# Altium schematic sheet Power.SchDoc
size A4; SheetNumber: 2; SheetTotal: 7
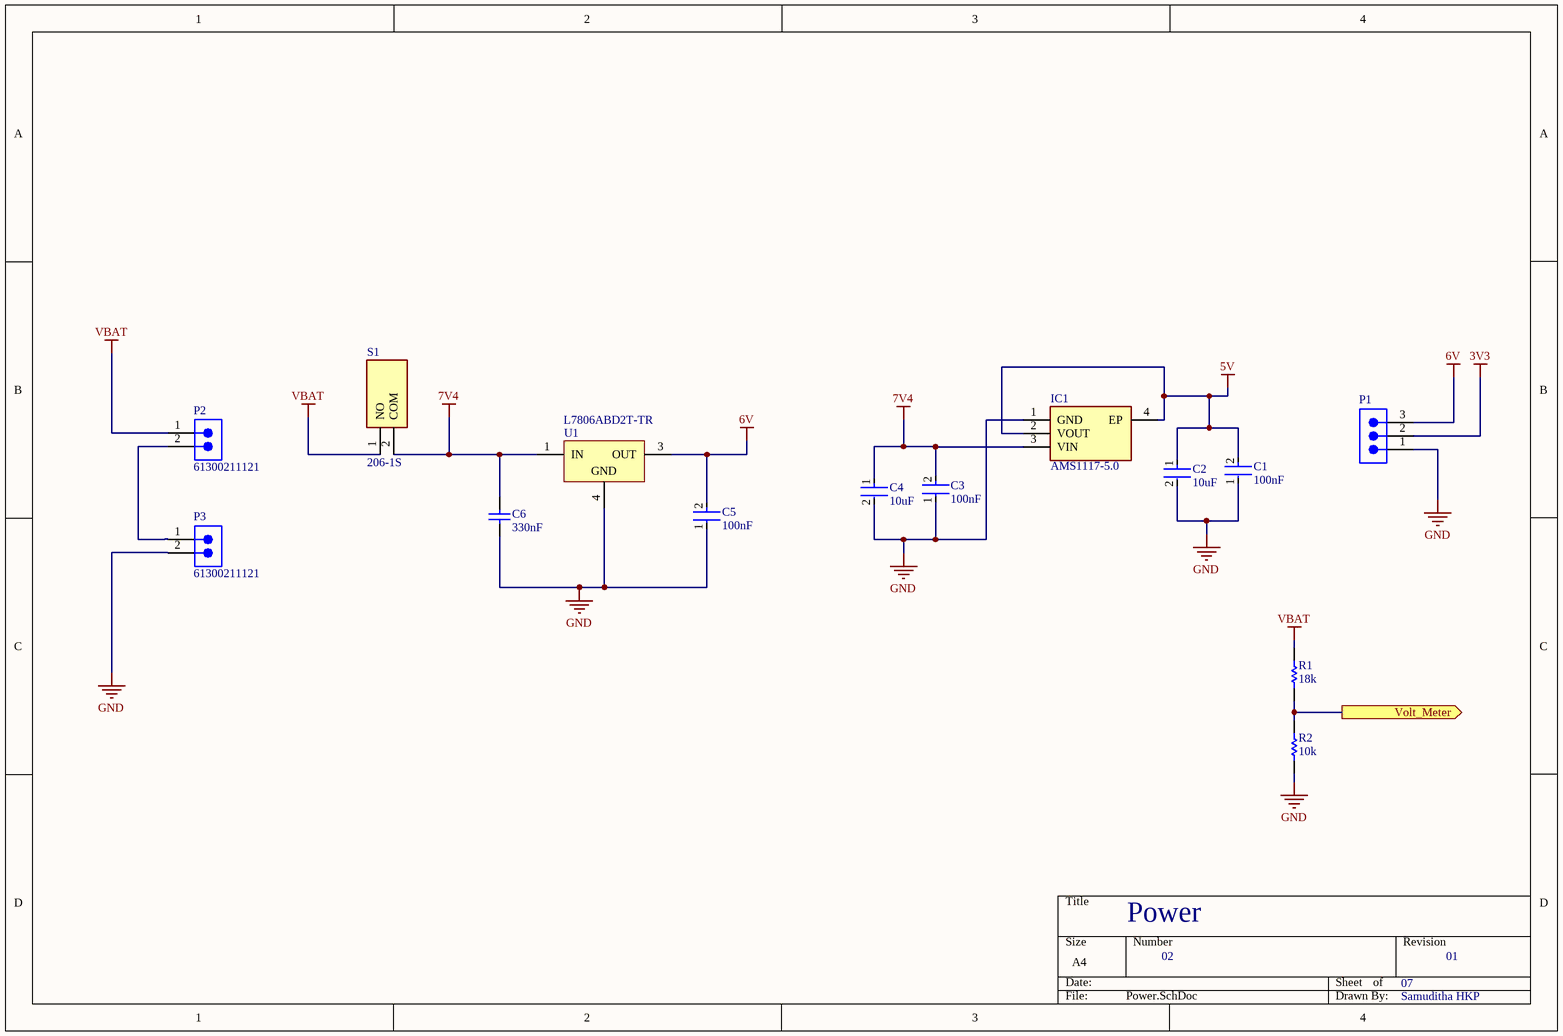
[diagram p0: Power.SchDoc]

## Parts
C1  100nF  [FP-GRM15-MFG]
C2  10uF  [FP-GRM155-0_15-IPC_B]
C3  100nF  [FP-GRM15-MFG]
C4  10uF  [FP-GRM155-0_15-IPC_B]
C5  100nF  [FP-GRM15-MFG]
C6  330nF  [CAPC1005X55X25ML05T10]
IC1  AMS1117-5.0  [SOT290P700X180-4N]
P1  61300311021  [61300311021]  (value not drawn)
P2  61300211121  [61300211121]
P3  61300211121  [61300211121]
R1  18k  [RESC1005X40X25LL05T10]
R2  10k  [RESC1005X40X25LL05T10]
S1  206-1S  [2061S]
U1  L7806ABD2T-TR  [TO-263_N]

## Ports
Volt_Meter (out, see Main[1A], MCU[1A])

## Nets
3V3: P1.2
5V: C1.2 C2.1 IC1.2(VOUT) IC1.4(EP)
6V: C5.2 P1.3 U1.3(OUT)
7V4: C3.2 C4.1 C6.2 IC1.3(VIN) S1.2(COM) U1.1(IN)
GND: C1.1 C2.2 C3.1 C4.2 C5.1 C6.1 IC1.1(GND) P1.1 P3.2 R2.1 U1.4(GND)
VBAT: P2.1 R1.2 S1.1(NO)
Volt_Meter: R1.1 R2.2 ; port Volt_Meter
NetP2_2: P2.2 P3.1

## Notes on the sheet
- Power
- 02
- 07
- 01
- Samuditha HKP

## Library data of the parts
C1 C3 C5 = CMP-2100-03641-2: CAP CER 0.1UF 16V X7R 0402; Manufacturer Part Number: GRM155R71C104KA88D; Manufacturer: Murata; Standoff Height: 0mm; Tolerance: 10%; Voltage Rating: 16Vdc; Material: Ceramic; Capacitance: 0.10μF; Value: 0.10μF; RoHS: TRUE; Temperature Characteristic: X7R; Octopart: https://octopart.com/grm155r71c104ka88d-murata-196880; Digikey Description: CAP CER 0.1UF 16V X7R 0402; Device Class L3: Ceramic Capacitors; Height: 0.55mm; ComponentLink2Description: Datasheet; Temperature Range Low: -55°C; Ipc Land Pattern Name: CAPC10050X219; ComponentLink2URL: https://search.murata.co.jp/Ceramy/image/img/A01X/G101/ENG/GRM155R71H471KA01-01A.pdf; Device Class L1: Passive Components; Lead Free: yes; Category: Cap; Package: GRM15; Temperature: -55°C to +125°C; Device Class L2: Capacitors; Temperature Range High: +125°C; Mouser Description: 0402 0.1 uF 16V ±10 % Tolerance X7R SMT Multilayer Ceramic Capacitor
C2 C4 = CMP-06035-012416-1: Chip Multilayer Ceramic Capacitors for General Purpose, 0402, 10uF, X5R, 15%, 20%, 6.3V; Thickness: 0.026inch; Case Code (Imperial): 0402; Tolerance: 20%; Min Operating Temperature: -55°C; Length: 0.039inch; Packaging: Tape and Reel; Max Operating Temperature: 85°C; Case Code (Metric): 1005; Mount: Surface Mount; Dielectric: X5R; Capacitance: 10uF; Case/Package: 0402; Voltage Rating: 6.3V; Voltage Rating (DC): 6.3V; Width: 0.02inch
C6 = CMP-2008-03929-1: Part Number: GRM155R61A334KE15D; Manufacturer: Murata
IC1 = AMS1117-5.0: Integrated Circuit; Manufacturer_Name: Shikues; Datasheet Link: https://datasheet.lcsc.com/szlcsc/SK-AMS1117-5-0_C165483.pdf; Height: 1.8mm; Manufacturer_Part_Number: AMS1117-5.0
P1 = CMP-1502-01061-3: NexarPartId: 32855520; Contact Resistance: 20mΩ; Number of Positions: 3; Current Rating: 3A; Gender: Male; Operating Supply Voltage: 250V; Connector Type: Male Pin; Pitch: 2.54mm; Number of Rows: 1; Lead Pitch: 2.54mm; REACH SVHC: Unknown; Packaging: Bulk; Mount: Through Hole; Number of Pins: 3; Color: Black; Contact Plating: Gold; Contact Material: Copper; Number of Contacts: 3; Contact Mating Length: 5.9944mm; Termination: Solder; RoHS: Compliant
P2 P3 = CMP-1712-00002-6: NexarPartId: 20081794; Number of Contacts: 2; Pitch: 2.54mm; Connector Type: Male Pin; Voltage Rating: 250V; Current Rating: 3A; Gender: Male; Contact Resistance: 20mΩ; Height: 8.94mm; Lead Free: Lead Free; Number of Pins: 2; Termination: Through Hole; RoHS: Compliant; Lead Pitch: 2.54mm; REACH SVHC: No SVHC; Housing Material: PBT; Contact Mating Length: 5.9944mm; Min Operating Temperature: -40°C; Orientation: Vertical; Contact Material: Copper; Contact Gender: Male; Max Operating Temperature: 125°C; Number of Rows: 1; Number of Positions: 2; Packaging: Bulk; Contact Plating: Gold; Mount: Through Hole; Color: Black; Operating Supply Voltage: 250V
R1 = CMP-1011-00650-2: Part Number: RC0402FR-0718KL; Manufacturer: Yageo / Phycomp
R2 = CMP-2002-07353-1: Part Number: RC0402FR-0710KL; Manufacturer: Yageo / Phycomp
S1 = 206-1S: Switch; Manufacturer_Name: CTS; Datasheet Link: https://www.ctscorp.com/wp-content/uploads/206.pdf; Height: 8.89mm; Manufacturer_Part_Number: 206-1S
U1 = CMP-0244-00215-1: Positive Voltage Regulator, 3-Pin D2PAK, Tape and Reel; ComponentLink1Description: Manufacturer URL; DatasheetVersion: 16/11/2011; PackageVersion: 2011; ComponentLink2Description: Datasheet; PackageDescription: 3-Pin Transistor Outline Package 2.54 mm Pitch, 15.4 mm Lead Span (D2PAK); ComponentLink1URL: http://www.st.com; PackageReference: TO-263; ComponentLink2URL: http://www.st.com/internet/com/TECHNICAL_RESOURCES/TECHNICAL_LITERATURE/DATASHEET/CD00000444.pdf